# Altium schematic sheet PowerBoard-OLD.SchDoc
size A4
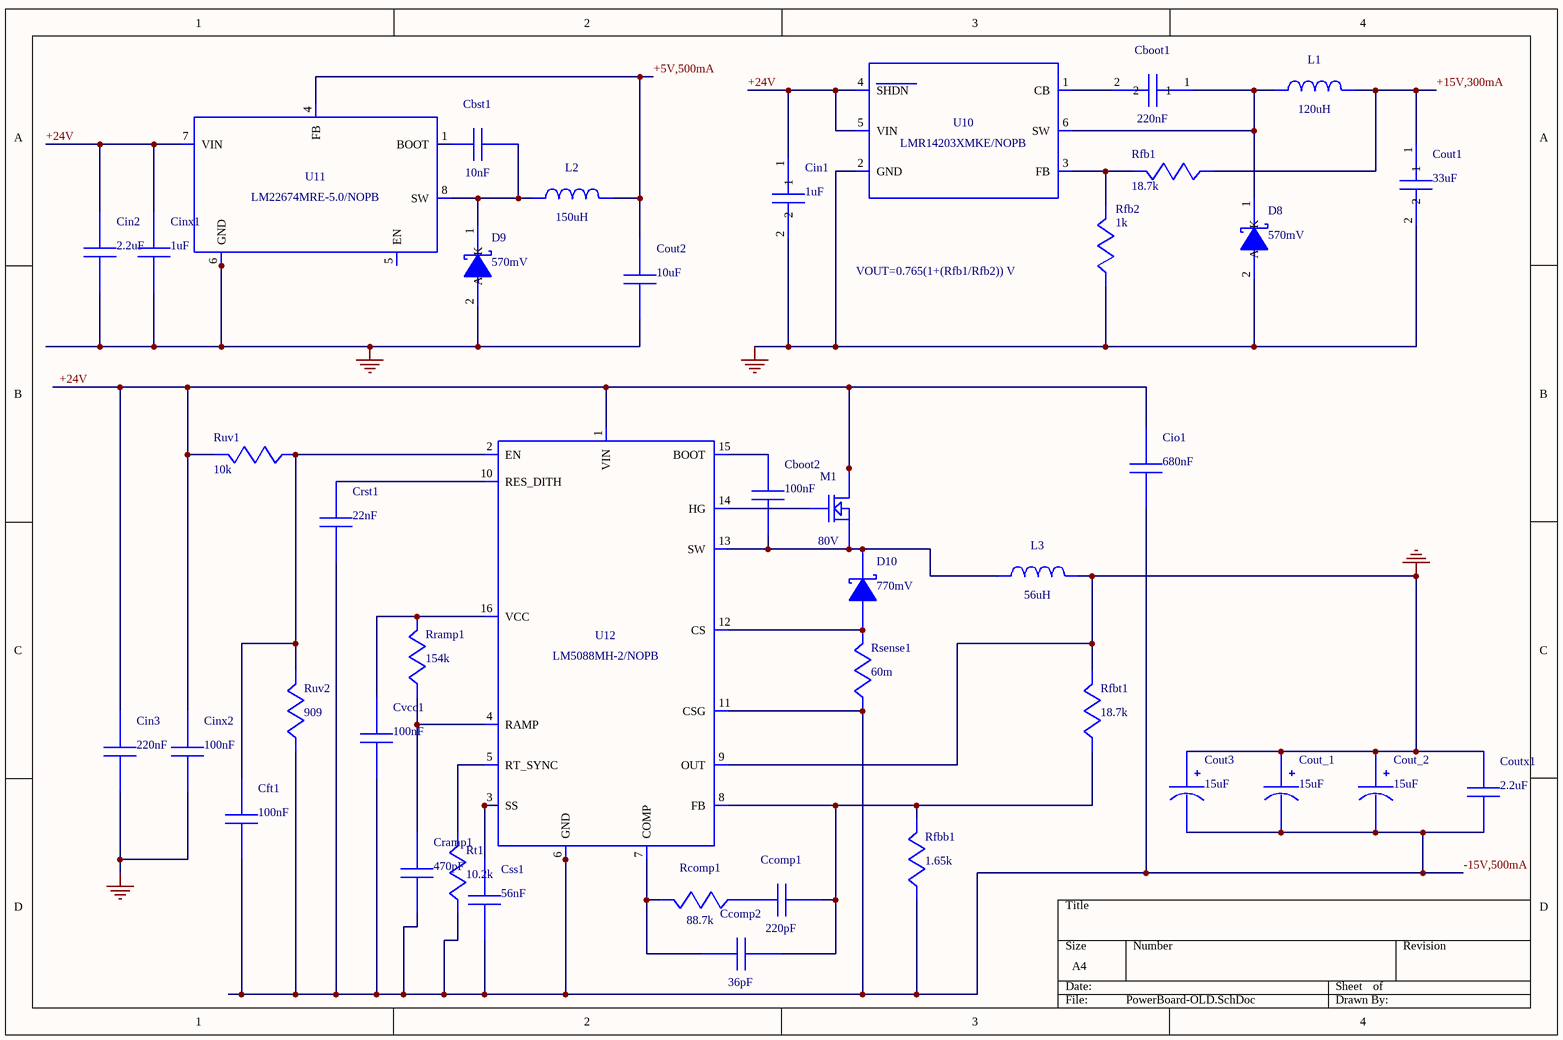
[diagram p0: PowerBoard-OLD.SchDoc]

## Parts
Cboot1  value 220nF  (hidden comment: GRM155C80G224KE01D)
Cboot2  value 100nF  (hidden comment: C0603C104K5RACTU)
Cbst1  value 10nF  (hidden comment: C0805C103K5RACTU)
Ccomp1  value 220pF  (hidden comment: CC0805JRNPO9BN221)
Ccomp2  value 36pF  (hidden comment: CL21C360JBANNNC)
Cft1  value 100nF  (hidden comment: GRM155R61A104KA01D)
Cin1  value 1uF  (hidden comment: C1608X5R1H105K080AB)
Cin2  value 2.2uF  (hidden comment: GRM31CR71H225KA88L)
Cin3  value 220nF  (hidden comment: C0805C224K5RACTU)
Cinx1  value 1uF  (hidden comment: C1608X5R1H105K080AB)
Cinx2  value 100nF  (hidden comment: C0805C104K5RACTU)
Cio1  value 680nF  (hidden comment: C2012X7S2A684K125AB)
Cout1  value 33uF  (hidden comment: C3216X5R1E336M160AC)
Cout2  value 10uF  (hidden comment: C0805C106K8PACTU)
Cout3  value 15uF  (hidden comment: T495C156K020ATE375)
Cout_1  value 15uF  (hidden comment: T495C156K020ATE375)
Cout_2  value 15uF  (hidden comment: T495C156K020ATE375)
Coutx1  value 2.2uF  (hidden comment: GRM21BR61E225KA12L)
Cramp1  value 470pF  (hidden comment: CC0805KRX7R9BB471)
Crst1  value 22nF  (hidden comment: GRM033C80J223KE01D)
Css1  value 56nF  (hidden comment: GRM155R61A563KA01D)
Cvcc1  value 100nF  (hidden comment: GRM155R61A104KA01D)
D8  value 570mV  (hidden comment: PMEG6010CEH,115)
D9  value 570mV  (hidden comment: PMEG6010CEH,115)
D10  value 770mV  (hidden comment: DFLS1100-7)
L1  value 120uH  (hidden comment: NPI75C121KTRF)
L2  value 150uH  (hidden comment: VLP8040T-151M)
L3  value 56uH  (hidden comment: SDR1307-560KL)
M1  value 80V  (hidden comment: BSC340N08NS3 G)
Rcomp1  value 88.7k  (hidden comment: CRCW040288K7FKED)
Rfb1  value 18.7k  (hidden comment: CRCW040218K7FKED)
Rfb2  value 1k  (hidden comment: CRCW04021K00FKED)
Rfbb1  value 1.65k  (hidden comment: CRCW04021K65FKED)
Rfbt1  value 18.7k  (hidden comment: CRCW040218K7FKED)
Rramp1  value 154k  (hidden comment: CRCW0402154KFKED)
Rsense1  value 60m  (hidden comment: CSRN2010FK60L0)
Rt1  value 10.2k  (hidden comment: CRCW040210K2FKED)
Ruv1  value 10k  (hidden comment: CRCW040210K0FKED)
Ruv2  value 909  (hidden comment: CRCW0402909RFKED)
U10  PackageReference: LMR14203XMKE/NOPB  (hidden comment: LMR14203XMK/NOPB)
U11  LM22674MRE-5.0/NOPB
U12  LM5088MH-2/NOPB

## Nets
0: Cin1.2 Cin2.2 Cin3.2 Cinx1.2 Cinx2.2 Cout1.2 Cout2.2 Cout3.1(+) Cout_1.1(+) Cout_2.1(+) Coutx1.1 D8.2(A) D9.2(A) L3.2 Rfb2.2 Rfbt1.1 U10.2(GND) U11.2(NC) U11.3(NC) U11.6(GND) U11.9(DAP) U12.9(OUT)
+5V,500mA: Cout2.1 L2.2 U11.4(FB)
+15V,300mA: Cout1.1 L1.2 Rfb1.2
+24V: Cin1.1 Cin2.1 Cin3.1 Cinx1.1 Cinx2.1 Cio1.1 M1.5(Drain) M1.6(Drain) M1.7(Drain) M1.8(Drain) M1.9(Drain) Ruv1.1 U10.4(SHDN) U10.5(VIN) U11.7(VIN) U12.1(VIN)
-15V,500mA: Cft1.2 Cio1.2 Cout3.2(-) Cout_1.2(-) Cout_2.2(-) Coutx1.2 Cramp1.2 Crst1.2 Css1.2 Cvcc1.2 Rfbb1.2 Rsense1.2 Rt1.2 Ruv2.2 U12.6(GND) U12.11(CSG) U12.17(EP)
NetCboot1_1: Cboot1.1 D8.1(K) L1.1 U10.6(SW)
NetCboot1_2: Cboot1.2 U10.1(CB)
NetCboot2_1: Cboot2.1 D10.1(K) L3.1 M1.1(Source) M1.2(Source) M1.3(Source) U12.13(SW)
NetCboot2_2: Cboot2.2 U12.15(BOOT)
NetCbst1_1: Cbst1.1 D9.1(K) L2.1 U11.8(SW)
NetCbst1_2: Cbst1.2 U11.1(BOOT)
NetCcomp1_1: Ccomp1.1 Rcomp1.2
NetCcomp1_2: Ccomp1.2 Ccomp2.2 Rfbb1.1 Rfbt1.2 U12.8(FB)
NetCcomp2_1: Ccomp2.1 Rcomp1.1 U12.7(COMP)
NetCft1_1: Cft1.1 Ruv1.2 Ruv2.1 U12.2(EN)
NetCramp1_1: Cramp1.1 Rramp1.2 U12.4(RAMP)
NetCrst1_1: Crst1.1 U12.10(RES_DITH)
NetCss1_1: Css1.1 U12.3(SS)
NetCvcc1_1: Cvcc1.1 Rramp1.1 U12.16(VCC)
NetD10_2: D10.2(A) Rsense1.1 U12.12(CS)
NetM1_4: M1.4(Gate) U12.14(HG)
NetRfb1_1: Rfb1.1 Rfb2.1 U10.3(FB)
NetRt1_1: Rt1.1 U12.5(RT_SYNC)

Not connected (* = marked no-connect by the designer): U11 5(EN)

## Notes on the sheet
- VOUT=0.765(1+(Rfb1/Rfb2)) V

## Library data of the parts
Cboot1 = GRM155C80G224KE01D: GRM155C80G224KE0; Manufacturer Name: MuRata; PackageReference: GRM155C80G224KE01D; Manufacturer Part Number: GRM155C80G224KE01D
Cboot2 = C0603C104K5RACTU: Manufacturer Name: Kemet; PackageReference: C0603C104K5RACTU; Manufacturer Part Number: C0603C104K5RACTU
Cbst1 = C0805C103K5RACTU: Manufacturer Name: Kemet; PackageReference: C0805C103K5RACTU; Manufacturer Part Number: C0805C103K5RACTU
Ccomp1 = CC0805JRNPO9BN221: CC0805JRNPO9BN22; Manufacturer Name: Yageo America; PackageReference: CC0805JRNPO9BN221; Manufacturer Part Number: CC0805JRNPO9BN221
Ccomp2 = CL21C360JBANNNC: Manufacturer Name: Samsung Electro-Mechanics; PackageReference: CL21C360JBANNNC; Manufacturer Part Number: CL21C360JBANNNC
Cft1 Cvcc1 = GRM155R61A104KA01D: GRM155R61A104KA0; Manufacturer Name: MuRata; PackageReference: GRM155R61A104KA01D; Manufacturer Part Number: GRM155R61A104KA01D
Cin1 Cinx1 = C1608X5R1H105K080AB: C1608X5R1H105K08; Manufacturer Name: TDK; PackageReference: C1608X5R1H105K080AB; Manufacturer Part Number: C1608X5R1H105K080AB
Cin2 = GRM31CR71H225KA88L: GRM31CR71H225KA8; Manufacturer Name: MuRata; PackageReference: GRM31CR71H225KA88L; Manufacturer Part Number: GRM31CR71H225KA88L
Cin3 = C0805C224K5RACTU: Manufacturer Name: Kemet; PackageReference: C0805C224K5RACTU; Manufacturer Part Number: C0805C224K5RACTU
Cinx2 = C0805C104K5RACTU: Manufacturer Name: Kemet; PackageReference: C0805C104K5RACTU; Manufacturer Part Number: C0805C104K5RACTU
Cio1 = C2012X7S2A684K125AB: C2012X7S2A684K12; Manufacturer Name: TDK; PackageReference: C2012X7S2A684K125AB; Manufacturer Part Number: C2012X7S2A684K125AB
Cout1 = C3216X5R1E336M160AC: C3216X5R1E336M16; Manufacturer Name: TDK; PackageReference: C3216X5R1E336M160AC; Manufacturer Part Number: C3216X5R1E336M160AC
Cout2 = C0805C106K8PACTU: Manufacturer Name: Kemet; PackageReference: C0805C106K8PACTU; Manufacturer Part Number: C0805C106K8PACTU
Cout3 Cout_1 Cout_2 = T495C156K020ATE375: T495C156K020ATE3; Manufacturer Name: Kemet; PackageReference: T495C156K020ATE375; Manufacturer Part Number: T495C156K020ATE375
Coutx1 = GRM21BR61E225KA12L: GRM21BR61E225KA1; Manufacturer Name: MuRata; PackageReference: GRM21BR61E225KA12L; Manufacturer Part Number: GRM21BR61E225KA12L
Cramp1 = CC0805KRX7R9BB471: CC0805KRX7R9BB47; Manufacturer Name: Yageo America; PackageReference: CC0805KRX7R9BB471; Manufacturer Part Number: CC0805KRX7R9BB471
Crst1 = GRM033C80J223KE01D: GRM033C80J223KE0; Manufacturer Name: MuRata; PackageReference: GRM033C80J223KE01D; Manufacturer Part Number: GRM033C80J223KE01D
Css1 = GRM155R61A563KA01D: GRM155R61A563KA0; Manufacturer Name: MuRata; PackageReference: GRM155R61A563KA01D; Manufacturer Part Number: GRM155R61A563KA01D
D8 D9 = PMEG6010CEH,115: Manufacturer Name: Nexperia; PackageReference: PMEG6010CEH,115; Manufacturer Part Number: PMEG6010CEH,115
D10 = DFLS1100-7: Manufacturer Name: Diodes Inc.; PackageReference: DFLS1100-7; Manufacturer Part Number: DFLS1100-7
L1 = NPI75C121KTRF: Manufacturer Name: NIC Components; PackageReference: NPI75C121KTRF; Manufacturer Part Number: NPI75C121KTRF
L2 = VLP8040T-151M: Unknown; Manufacturer Name: TDK; PackageReference: VLP8040T-151M; Manufacturer Part Number: VLP8040T-151M
L3 = SDR1307-560KL: Manufacturer Name: Bourns; PackageReference: SDR1307-560KL; Manufacturer Part Number: SDR1307-560KL
M1 = BSC340N08NS3 G: Manufacturer Name: Infineon Technologies; PackageReference: BSC340N08NS3 G; Manufacturer Part Number: BSC340N08NS3 G
Rcomp1 = CRCW040288K7FKED: Manufacturer Name: Vishay-Dale; PackageReference: CRCW040288K7FKED; Manufacturer Part Number: CRCW040288K7FKED
Rfb1 Rfbt1 = CRCW040218K7FKED: Manufacturer Name: Vishay-Dale; PackageReference: CRCW040218K7FKED; Manufacturer Part Number: CRCW040218K7FKED
Rfb2 = CRCW04021K00FKED: Manufacturer Name: Vishay-Dale; PackageReference: CRCW04021K00FKED; Manufacturer Part Number: CRCW04021K00FKED
Rfbb1 = CRCW04021K65FKED: Manufacturer Name: Vishay-Dale; PackageReference: CRCW04021K65FKED; Manufacturer Part Number: CRCW04021K65FKED
Rramp1 = CRCW0402154KFKED: Manufacturer Name: Vishay-Dale; PackageReference: CRCW0402154KFKED; Manufacturer Part Number: CRCW0402154KFKED
Rsense1 = CSRN2010FK60L0: Manufacturer Name: Stackpole Electronics Inc; PackageReference: CSRN2010FK60L0; Manufacturer Part Number: CSRN2010FK60L0
Rt1 = CRCW040210K2FKED: Manufacturer Name: Vishay-Dale; PackageReference: CRCW040210K2FKED; Manufacturer Part Number: CRCW040210K2FKED
Ruv1 = CRCW040210K0FKED: Manufacturer Name: Vishay-Dale; PackageReference: CRCW040210K0FKED; Manufacturer Part Number: CRCW040210K0FKED
Ruv2 = CRCW0402909RFKED: Manufacturer Name: Vishay-Dale; PackageReference: CRCW0402909RFKED; Manufacturer Part Number: CRCW0402909RFKED
U10 = LMR14203XMK/NOPB: LMR14203XMKE/NOP; Manufacturer Name: Texas Instruments; Manufacturer Part Number: LMR14203XMK/NOPB; Value: N/A
U11 = LM22674MRE-5.0/NOPB: LM22674MRE-5.0/N; Manufacturer Name: Texas Instruments; PackageReference: LM22674MRE-5.0/NOPB; Manufacturer Part Number: LM22674MRE-5.0/NOPB; Value: Value
U12 = LM5088MH-2/NOPB: Manufacturer Name: Texas Instruments; PackageReference: LM5088MH-2/NOPB; Manufacturer Part Number: LM5088MH-2/NOPB; Value: N/A